# EAGLE design auc_pulser (EAGLE 9.2.2)
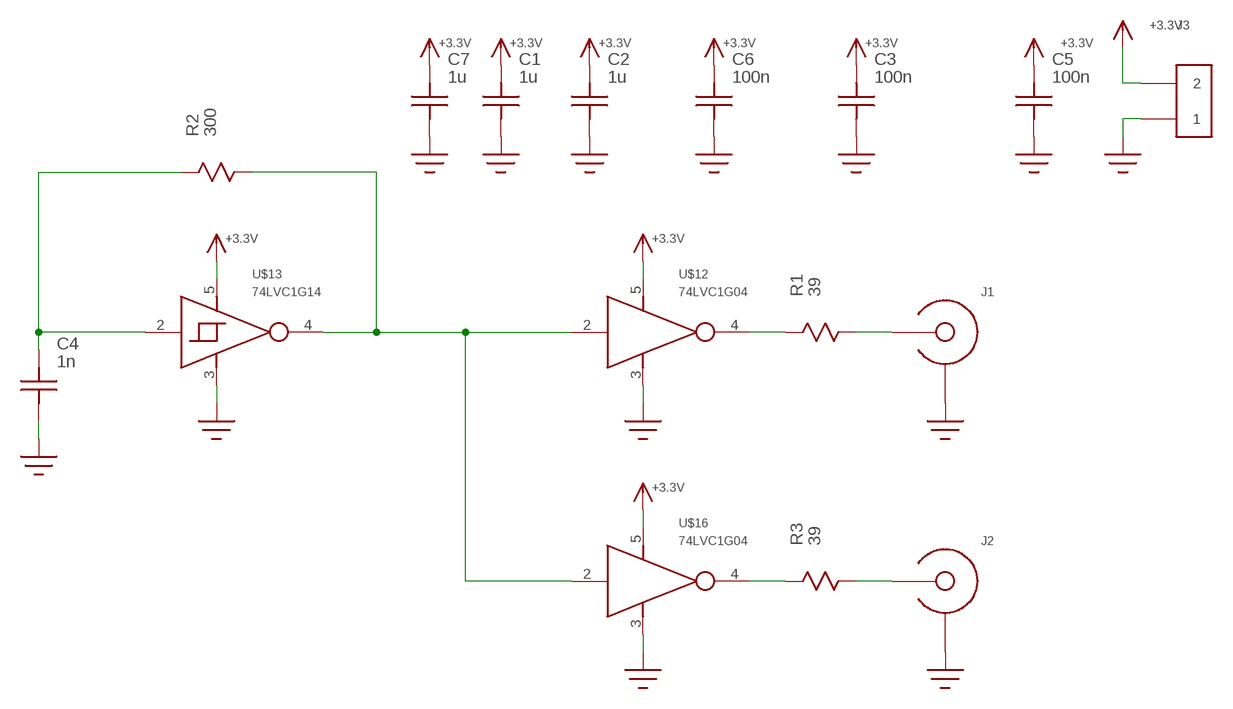
[diagram p0: schematic, sheet 1]

## Parts
C1  1u  C0805  [0805]
C2  1u  C0805  [0805]
C3  100n  C0603  [C0603]
C4  1n  C0603  [C0603]
C5  100n  C0603  [C0603]
C6  100n  C0603  [C0603]
C7  1u  C0805  [0805]
J1  BNC_MALE_PCB  [BNC_MALE_PCB]
J2  EDGE_LAUNCH_JACK  [EDGE_LAUNCH_RF_CON]
J3  HEADER_2PIN  [HEADER_2PIN]
R1  39  R0603  [R0603]
R2  300  R0603  [R0603]
R3  39  R0603  [R0603]
U$12  74LVC1G04  [SOT23-5]
U$13  74LVC1G14  [SOT23-5]
U$16  74LVC1G04  [SOT23-5]

## Nets
+3.3V: C1.P$2 C2.P$2 C3.P$2 C5.P$2 C6.P$2 C7.P$2 J3.2 U$12.5(VCC) U$13.5(VCC) U$16.5(VCC)
GND: C1.P$1 C2.P$1 C3.P$1 C4.P$1 C5.P$1 C6.P$1 C7.P$1 J1.SHIELD@1(SHIELD) J1.SHIELD@2(SHIELD) J1.SHIELD@3(SHIELD) J1.SHIELD@4(SHIELD) J2.GND@1(SHIELD) J2.GND@2(SHIELD) J2.GND@3(SHIELD) J2.GND@4(SHIELD) J2.GND@5(SHIELD) J2.GND@6(SHIELD) J2.GND@7(SHIELD) J2.GND@8(SHIELD) J2.GND@9(SHIELD) J2.GND@10(SHIELD) J2.GND@11(SHIELD) J2.GND@12(SHIELD) J2.SHIELD@1(SHIELD) J2.SHIELD@2(SHIELD) J3.1 U$12.3(GND) U$13.3(GND) U$16.3(GND)
N$1: J1.CENTER R1.P$2
N$2: R1.P$1 U$12.4(OUT)
N$3: C4.P$2 R2.P$1 U$13.2(IN)
N$4: R2.P$2 U$12.2(IN) U$13.4(OUT) U$16.2(IN)
N$5: J2.CENTER R3.P$2
N$6: R3.P$1 U$16.4(OUT)

## Library data of the parts
C1-C7 = yapo:C
J1 = yapo:BNC_MALE_PCB
J2 = yapo:EDGE_LAUNCH_JACK
J3 = yapo:HEADER_2PIN
R1-R3 = yapo:R
U$12 U$16 = yapo:74LVC1G04
U$13 = yapo:74LVC1G14

## Board
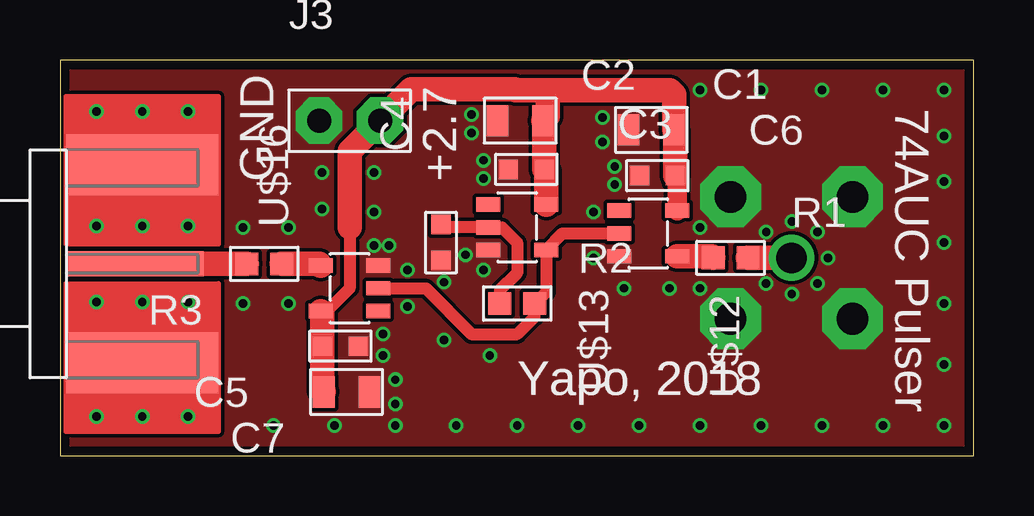
[diagram p1: board, top side]
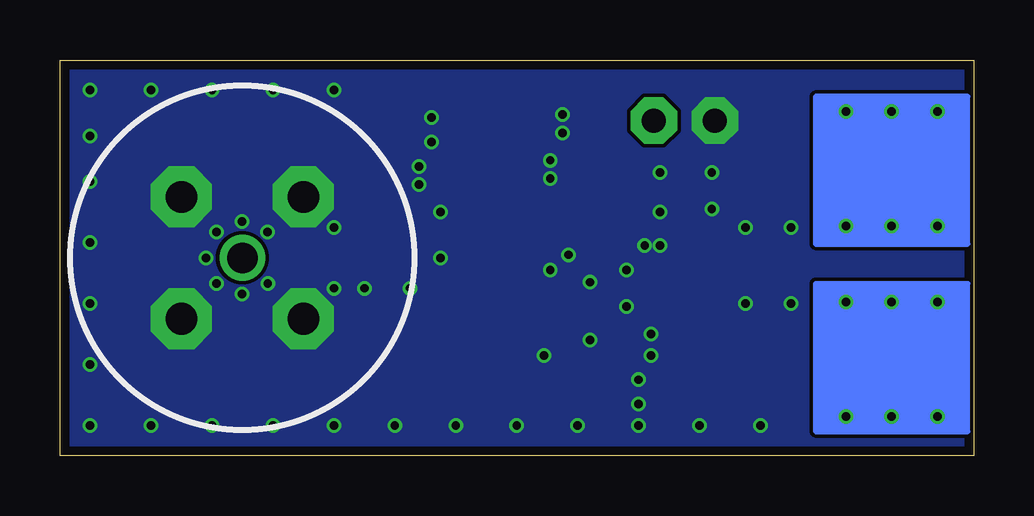
[diagram p2: board, bottom side, seen from below]

Size 38.08 x 16.5 mm. Coordinates in mm from the lower left corner, seen from the top.
Outline: 0,0 38.08,0 38.08,16.5 0,16.5 0,0
Copper layers (1*16): Top 0.035559375mm / dielectric 1.6mm / Bottom 0.035559375mm
Design rules "oshpark-2layer *": minimum track width 6mil, minimum drill 10mil, track to track 6mil, track to pad 6mil, pad to pad 6mil, via to via 6mil, smd to smd 6mil, copper to edge 15mil, drill to drill 6mil, minimum pad ring 5mil, minimum via ring 5mil, stop-mask expansion 2.5mil, vias tented up to drill 20mil, thermal gap 10mil

### Footprints (pad centres in the part's own frame; a part is rotated, then mirrored left to right if it is on the bottom)
0805 = smd 0.9 x 1.3: P$1 -0.95,0; P$2 0.95,0
C0603 = smd 0.8 x 0.8: P$1 -0.75,0; P$2 0.75,0
BNC_MALE_PCB = drill 1.27 pad 1.778: CENTER 0,0 | drill 1.321 pad 2.54 octagon: SHIELD@1 -2.54,-2.54; SHIELD@2 -2.54,2.54; SHIELD@3 2.54,2.54; SHIELD@4 2.54,-2.54
EDGE_LAUNCH_RF_CON = smd 5.715 x 1.041: CENTER -2.875,0 | drill 0.35: GND@1 -5.08,1.587; GND@2 -3.175,1.587; GND@3 -1.27,1.587; GND@4 -5.08,-1.587; GND@5 -3.175,-1.587; GND@6 -1.27,-1.587; GND@7 -5.08,6.35; GND@8 -3.175,6.35; GND@9 -1.27,6.35; GND@10 -5.08,-6.35; GND@11 -3.175,-6.35; GND@12 -1.27,-6.35 | smd 6.35 x 2.54: SHIELD@1 -3.175,-4.128; SHIELD@2 -3.175,4.128
HEADER_2PIN = drill 1 pad 1.93 octagon: 1 -1.27,0; 2 1.27,0
R0603 = smd 0.95 x 0.95: P$1 -0.725,0; P$2 0.725,0
SOT23-5 = smd 0.6 x 1: 1 -0.95,-1.2; 2 0,-1.2; 3 0.95,-1.2; 4 0.95,1.2; 5 -0.95,1.2

### Placement (x,y rotation side)
C1  24.64,13.59 0 top
C2  19.18,13.97 0 top
C3  19.43,11.94 0 top
C4  15.88,8.89 90 top
C5  11.68,4.57 180 top
C6  24.89,11.68 0 top
C7  11.94,2.67 180 top
J1  30.48,8.26 0 top
J2  0.25,8 180 top
J3  12.06,13.97 0 top
R1  27.94,8.26 0 top
R2  19.05,6.35 0 top
R3  8.51,8 180 top
U$12  24.51,9.27 270 top
U$13  19.05,9.53 270 top
U$16  12.06,6.99 90 top

### Tracks (layer width: path | path; a pad name or v marks a point on that pad's centre or on a via)
+3.3V
  Top 0.508: 12.06,9.53 12.06,6.99 11.05,5.97 10.93,5.97
  Top 0.813: U$12.5 25.71,11.62 C6.P$2
  Top 1.016: U$13.5 20.25,11.87 C3.P$2 20.18,13.92 C2.P$2 20.32,14.16 20.32,15.24 | U$16.5 10.93,5.97 C5.P$2 10.93,2.72 C7.P$2 | C6.P$2 25.64,13.54 C1.P$2 25.59,15.05 25.4,15.24 20.32,15.24 | 20.32,15.24 18.99,15.24 18.95,15.28 14.64,15.28 J3.2 12.06,12.7 12.06,9.53
GND  (via drill 0.35)
  other vias: 7.62,9.53 7.62,6.35 9.53,9.53 9.53,6.35 26.67,6.99 26.67,9.53 25.4,6.99 23.5,6.99 22.23,8.26 22.61,14.1 22.61,13.08 23.11,12.06 23.11,11.3 17.14,14.22 17.14,13.46 17.65,12.32 17.65,11.56 14.48,7.75 17.65,7.75 16.89,8.38 16,7.24 13.46,5.08 13.46,4.19 13.97,3.17 13.97,2.16 10.92,11.81 10.92,10.29 13.08,11.81 13.08,10.16 14.48,6.22 16,4.83 17.91,4.19 22.23,10.16 32,8.26 31.56,7.19 30.49,6.75 29.42,7.19 29.43,9.33 30.5,9.77 31.56,9.32 8.89,1.27 11.43,1.27 13.97,1.27 16.51,1.27 19.05,1.27 21.59,1.27 24.13,1.27 26.67,1.27 29.21,1.27 31.75,1.27 34.29,1.27 36.83,1.27 36.83,3.81 36.83,6.35 36.83,8.89 36.83,11.43 36.83,13.34 36.83,15.24 34.29,15.24 31.75,15.24 29.21,15.24 26.67,15.24 13.08,8.76 13.72,8.76
  pour Top (no thermals): 0,0 38.1,0 38.1,16.51 0,16.51
  pour Bottom (no thermals): 0,0 38.1,0 38.1,16.51 0,16.51
N$1
  Top 1.016: J1.CENTER R1.P$2
N$2
  Top 1.016: R1.P$1 27.15,8.32 U$12.4
N$3
  Top 0.508: C4.P$2 15.99,9.53 U$13.2 18.41,9.53 19.05,8.89 19.05,7.62 18.32,6.89 R2.P$1
N$4
  Top 0.508: U$16.2 15.24,6.99 17.14,5.08 19.05,5.08 19.77,5.8 R2.P$2 20.25,6.83 U$13.4 20.95,9.27 U$12.2
N$5
  Top 1.016: J2.CENTER R3.P$2
N$6
  Top 1.016: R3.P$1 10.8,8 U$16.4

### Text on the board
tPlace: 74AUC Pulser | GND | +2.7 | Yapo, 2018 | Yapo, 2018